# Altium schematic sheet POG_PIN_Board.SchDoc
size A4
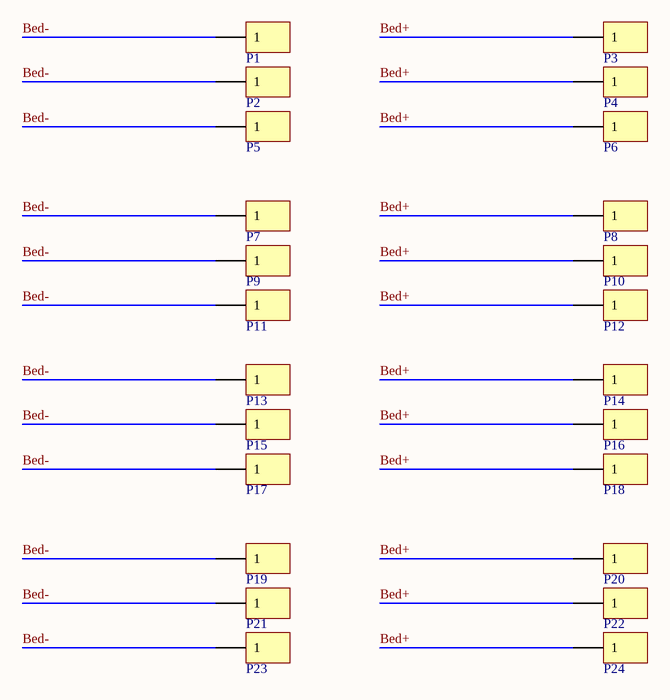
[diagram p0: POG_PIN_Board.SchDoc]

## Parts
P1  CONN_X1  [SUN_Hole]  (value not drawn)
P2  CONN_X1  [SUN_Hole]  (value not drawn)
P3  CONN_X1  [SUN_Hole]  (value not drawn)
P4  CONN_X1  [SUN_Hole]  (value not drawn)
P5  CONN_X1  [SUN_Hole]  (value not drawn)
P6  CONN_X1  [SUN_Hole]  (value not drawn)
P7  CONN_X1  [SUN_Hole_medium]  (value not drawn)
P8  CONN_X1  [SUN_Hole_medium]  (value not drawn)
P9  CONN_X1  [SUN_Hole_medium]  (value not drawn)
P10  CONN_X1  [SUN_Hole_medium]  (value not drawn)
P11  CONN_X1  [SUN_Hole_medium]  (value not drawn)
P12  CONN_X1  [SUN_Hole_medium]  (value not drawn)
P13  CONN_X1  [SUN_Hole]  (value not drawn)
P14  CONN_X1  [SUN_Hole]  (value not drawn)
P15  CONN_X1  [SUN_Hole]  (value not drawn)
P16  CONN_X1  [SUN_Hole]  (value not drawn)
P17  CONN_X1  [SUN_Hole]  (value not drawn)
P18  CONN_X1  [SUN_Hole]  (value not drawn)
P19  CONN_X1  [SUN_Hole_medium]  (value not drawn)
P20  CONN_X1  [SUN_Hole_medium]  (value not drawn)
P21  CONN_X1  [SUN_Hole_medium]  (value not drawn)
P22  CONN_X1  [SUN_Hole_medium]  (value not drawn)
P23  CONN_X1  [SUN_Hole_medium]  (value not drawn)
P24  CONN_X1  [SUN_Hole_medium]  (value not drawn)

## Nets
Bed+: P3.1 P4.1 P6.1 P8.1 P10.1 P12.1 P14.1 P16.1 P18.1 P20.1 P22.1 P24.1
Bed-: P1.1 P2.1 P5.1 P7.1 P9.1 P11.1 P13.1 P15.1 P17.1 P19.1 P21.1 P23.1